# EAGLE design CAN Wing v0.1A (EAGLE 9.3.1)
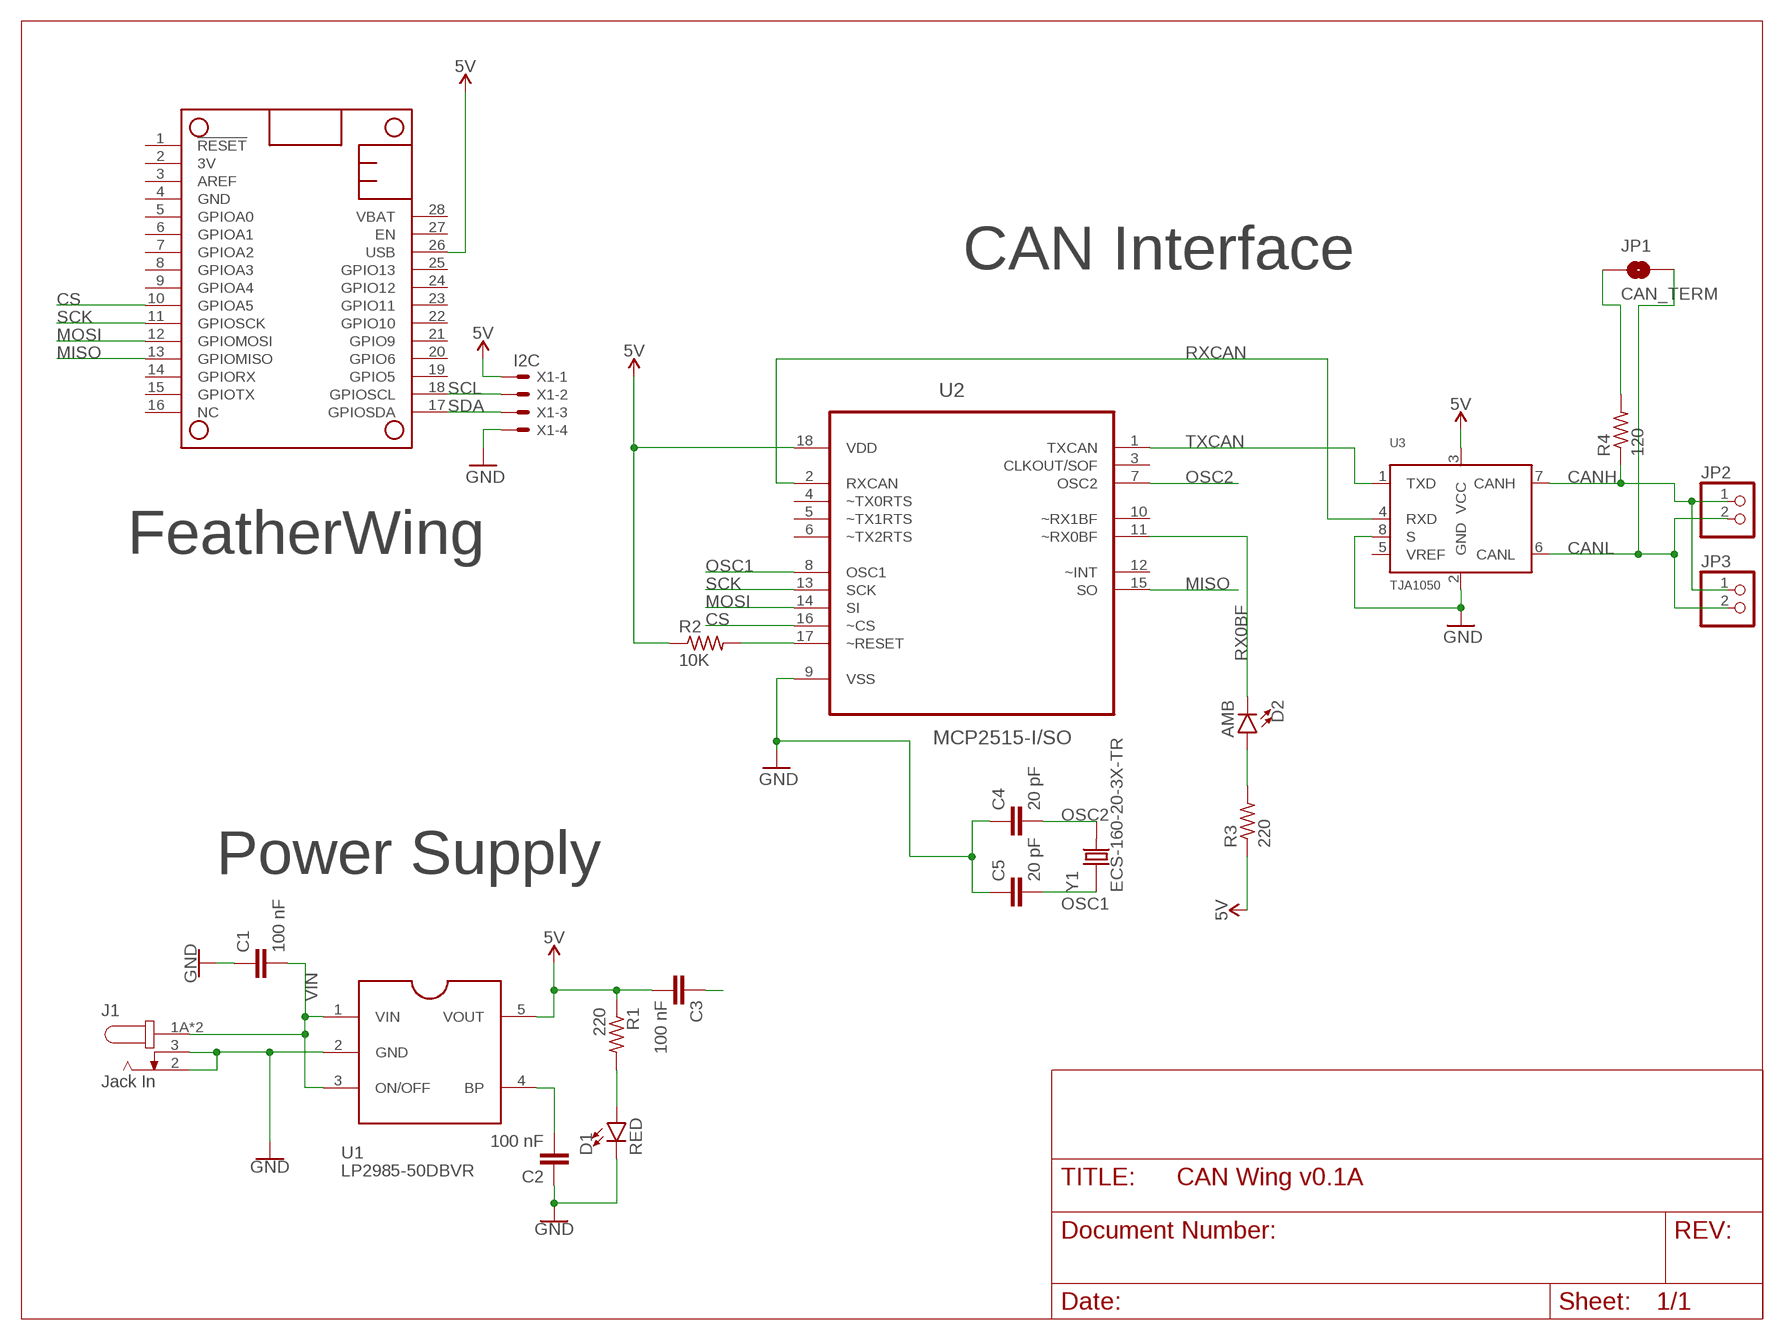
[diagram p0: schematic, sheet 1]

## Parts
C1  100 nF  C-EUC0603  [C0603]
C2  100 nF  C-EUC0603  [C0603]
C3  100 nF  C-EUC0603  [C0603]
C4  20 pF  C-EUC0603  [C0603]
C5  20 pF  C-EUC0603  [C0603]
D1  RED  LED0603  [LED-0603]
D2  AMB  LED0603  [LED-0603]
J1  Jack In  PJ-002AH-SMT-TR  [CUI_PJ-002AH-SMT-TR]
JP1  CAN_TERM  JUMPER-SMT_2_NO_NO-SILK  [SMT-JUMPER_2_NO_NO-SILK]
JP2  PINHD-1X2/90  [1X02/90]
JP3  PINHD-1X2/90  [1X02/90]
MS1  FEATHERWING  [FEATHERWING]
R1  220  R-US_R0603  [R0603]
R2  10K  R-US_R0603  [R0603]
R3  220  R-US_R0603  [R0603]
R4  120  R-US_R0603  [R0603]
U1  LP2985-50DBVR  [SOT23-5]
U2  MCP2515-I/SO  [SOIC127P1034X264-18N]
U3  TJA1050  [SOT96-1]
X1  I2C  JST-XH-04-PIN-LONG-PAD  [JST-XH-04-PACKAGE-LONG-PAD]
Y1  ECS-160-20-3X-TR  [XTAL_ECS-160-20-3X-TR]

## Nets
5V: C3.2 MS1.26(USB) R1.1 R2.1 R3.1 U1.5(VOUT) U2.18(VDD) U3.3(VCC) X1.1
CANH: JP2.1 JP3.1 R4.1 U3.7(CANH)
CANL: JP1.2 JP2.2 JP3.2 U3.6(CANL)
CS: MS1.10(GPIOA5) U2.16(~CS)
GND: C1.1 C2.1 C3.1 C4.1 C5.1 D1.C J1.2 J1.3 U1.2(GND) U2.9(VSS) U3.2(GND) U3.8(S) X1.4
MISO: MS1.13(GPIOMISO) U2.15(SO)
MOSI: MS1.12(GPIOMOSI) U2.14(SI)
N$3: JP1.1 R4.2
N$4: R2.2 U2.17(~RESET)
N$7: C2.2 U1.4(BP)
N$8: D1.A R1.2
N$9: D2.A R3.2
OSC1: C5.2 U2.8(OSC1) Y1.1
OSC2: C4.2 U2.7(OSC2) Y1.2
RX0BF: D2.C U2.11(~RX0BF)
RXCAN: U2.2(RXCAN) U3.4(RXD)
SCK: MS1.11(GPIOSCK) U2.13(SCK)
SCL: MS1.18(GPIOSCL) X1.2
SDA: MS1.17(GPIOSDA) X1.3
TXCAN: U2.1(TXCAN) U3.1(TXD)
VIN: C1.2 J1.1A J1.1B U1.1(VIN) U1.3(ON/OFF)
Unconnected: MS1.1(!RESET) MS1.2(3V) MS1.3(AREF) MS1.5(GPIOA0) MS1.6(GPIOA1) MS1.7(GPIOA2) MS1.8(GPIOA3) MS1.9(GPIOA4) MS1.14(GPIORX) MS1.15(GPIOTX) MS1.16(NC) MS1.19(GPIO5) MS1.20(GPIO6) MS1.21(GPIO9) MS1.22(GPIO10) MS1.23(GPIO11) MS1.24(GPIO12) MS1.25(GPIO13) MS1.27(EN) MS1.28(VBAT) U2.3(CLKOUT/SOF) U2.4(~TX0RTS) U2.5(~TX1RTS) U2.6(~TX2RTS) U2.10(~RX1BF) U2.12(~INT) U3.5(VREF)

## Notes on the sheet
- CAN Interface
- FeatherWing
- Power Supply

## Power pins joined to a net without a drawn wire
GND: MS1.4(GND)

## Library data of the parts
C1-C5 = rcl:C-EU: CAPACITOR, European symbol; SPICEPREFIX: C
D1 D2 = SparkFun-LED:LED: LED (Generic) Standard schematic elements and footprints for 5mm, 3mm, 1206, and 0603 sized LEDs. Generic LEDs with no color specified.
J1 = PJ-002AH-SMT-TR:PJ-002AH-SMT-TR: 2.0 mm Center Pin, 5.0 A, Right Angle, Surface Mount (SMT), Dc Power Jack Connector; CUI_PURCHASE_URL: https://www.cui.com/product/interconnect/dc-power-connectors/jacks/2.0-mm-center-pin/pj-002ah-smt-tr?utm_source=snapeda.com&utm_medium=referral&utm_campaign=snapedaBOM; DESCRIPTION: 24 VDC 5 A Surface Mount Unshielded 2 Conductors 3 Contacts Male Power Jack; DIGI-KEY_PART_NUMBER: CP-002AHPJCT-ND; DIGI-KEY_PURCHASE_URL: https://www.digikey.com/product-detail/en/cui-inc/PJ-002AH-SMT-TR/CP-002AHPJCT-ND/669692?utm_source=snapeda&utm_medium=aggregator&utm_campaign=symbol; MF: CUI Inc.; MP: PJ-002AH-SMT-TR; PACKAGE: None
JP1 = SparkFun-Jumpers:JUMPER-SMT_2_NO: Normally open jumper This jumper has two pads in close proximity to each other. Apply solder to close the connection. Round pads are easier to solder for beginners, but are a lot larger. SparkFun Product that uses the round pads: SparkFun EL Sequencer <https://www.sparkfun.com/products/12781>
JP2 JP3 = pinhead:PINHD-1X2: PIN HEADER
MS1 = microbuilder:FEATHERWING
R1-R4 = rcl:R-US_: RESISTOR, American symbol; SPICEPREFIX: R
U1 = LP2985-50DBVR:LP2985-50DBVR: http://octopart.com/lp2985-50dbvr-texas+instruments-525993; AVAILABILITY: Unavailable; DESCRIPTION: Single Output LDO, 150mA, Fixed_5.0V_, 1.5% Tolerance, Low Quiescent Current, Low Noise 5-SOT-23 -40 to 125; MF: Texas Instruments; MP: LP2985-50DBVR; PACKAGE: SOT-23 Texas Instruments; PRICE: None
U2 = MCP2515-I_SO:MCP2515-I/SO: CAN Controller; DESCRIPTION: MCP2515 Series 5.5 V 1 Mb/s Stand Alone SPI Interface CAN Controller- SOIC-18; DIGI-KEY_PART_NUMBER: MCP2515-I/SO-ND; DIGI-KEY_PURCHASE_URL: https://www.digikey.com/product-detail/en/microchip-technology/MCP2515-I-SO/MCP2515-I-SO-ND/593001?utm_source=snapeda&utm_medium=aggregator&utm_campaign=symbol; MF: Microchip; MP: MCP2515-I/SO; PACKAGE: SOIC-18 Microchip
U3 = TJA1050:TJA1050: High speed CAN transceiver The TJA1050 is the interface between the Controller Area Network (CAN) protocol controller and the physical bus. The device provides differential transmit capability to the bus and differential receive capability to the CAN controller. The TJA1050 is the third Philips high-speed CAN transceiver after the PCA82C250 and the PCA82C251. The most important differences are: Much lower electromagnetic emission due to optimal matching of the output signals CANH and CANL Improved behaviour in case of an unpowered node No standby mode. This makes the TJA1050 eminently suitable for use in nodes that are in a power-down situation in partially powered networks. AAL Eindhoven MK; DIGI-KEY_PART_NUMBER: 568-10292-1-ND; DIGI-KEY_PURCHASE_URL: https://www.digikey.com/product-detail/en/nxp-usa-inc/TJA1050T-CM,118/568-10292-1-ND/4162437?utm_source=snapeda&utm_medium=aggregator&utm_campaign=symbol; MF: NXP USA; MP: TJA1050; PACKAGE: SOIC-8 NXP USA
X1 = Rembrandt Electronics - JST XH Connectors v1-0:JST-XH-04-PIN: JST XH Connector 2 Pin Wire to board connector. Pitch: 2,54 mm, (0.100") Number of pins: 4 Created by Rembrandt Electronics www.rembrandtelectronics.com
Y1 = ECS-160-20-3X-TR:ECS-160-20-3X-TR: SMD QUARTZ CRYSTAL; AVAILABILITY: Unavailable; DESCRIPTION: CSM-3X Series 16 MHz ±30 ppm 20 pF -10 to +70 °C Surface Mount Quartz Crystal; MF: ECS Inc.; MP: ECS-160-20-3X-TR; PACKAGE: HC49/US ECS International; PRICE: None

## Board
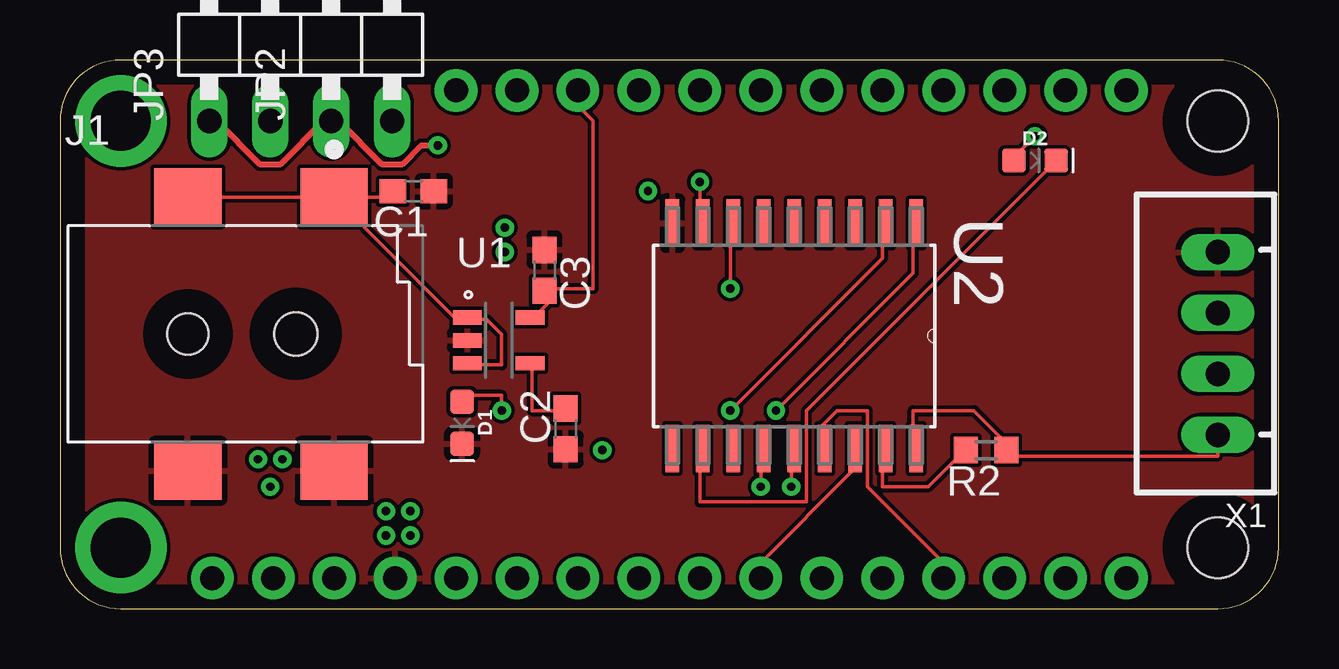
[diagram p1: board, top side]
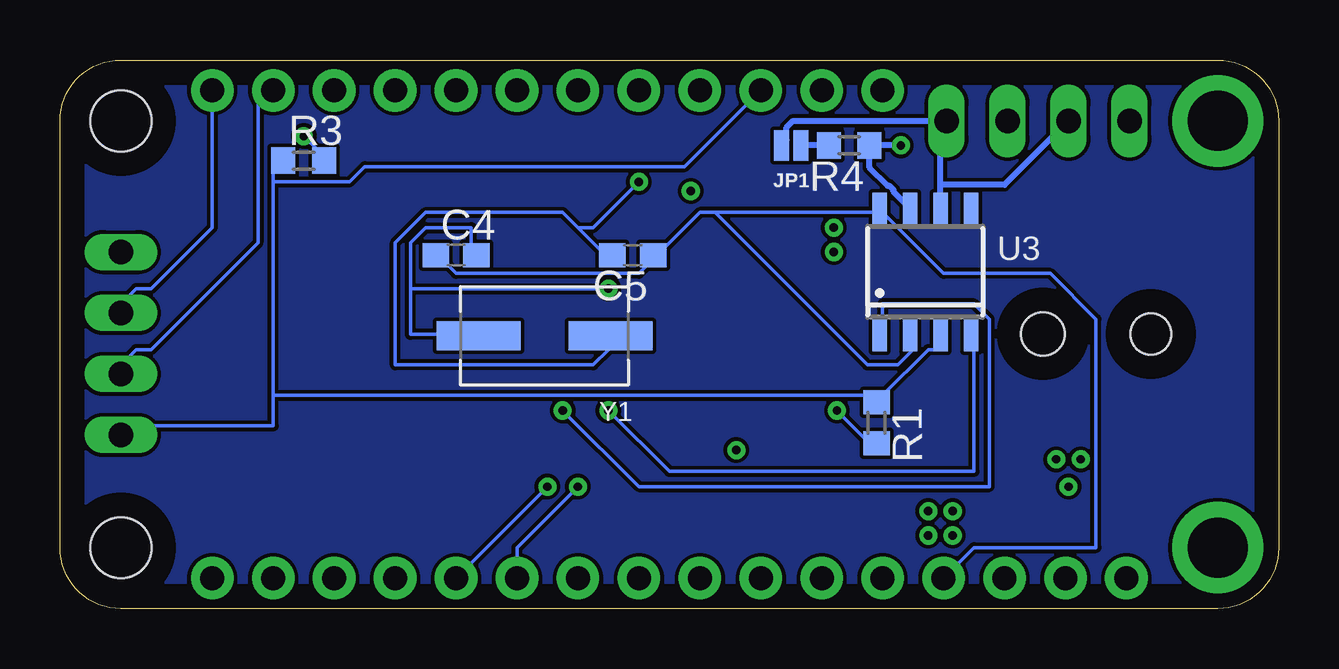
[diagram p2: board, bottom side, seen from below]

Size 50.8 x 22.86 mm. Coordinates in mm from the lower left corner, seen from the top.
Copper layers (1*16): Top 0.035mm / dielectric 1.5mm / Bottom 0.035mm
Design rules "default": minimum track width 6mil, minimum drill 0.35mm, track to track 6mil, track to pad 6mil, pad to pad 6mil, via to via 6mil, smd to smd 6mil, copper to edge 40mil, drill to drill 6mil, minimum pad ring 10mil, minimum via ring 8mil, stop-mask expansion 4mil, vias tented up to drill 0mil, thermal gap 10mil

### Footprints (pad centres in the part's own frame; a part is rotated, then mirrored left to right if it is on the bottom)
C0603 = smd 1.1 x 1: 1 -0.85,0; 2 0.85,0
LED-0603 = smd 1 x 1: A -0.877,0; C 0.877,0
CUI_PJ-002AH-SMT-TR = smd 2.8 x 2.4: 1A 0,0; 1B -6.1,0; 2 -6.1,-11.4; 3 0,-11.4 | hole 1.7: -6.1,-5.7 | hole 1.8: -1.6,-5.7
SMT-JUMPER_2_NO_NO-SILK = smd 0.635 x 1.27: 1 -0.406,0; 2 0.406,0
1X02/90 = drill 1.016 long: 1 -1.27,-3.81; 2 1.27,-3.81
FEATHERWING = drill 1 pad 1.778: 1 6.35,1.27; 2 8.89,1.27; 3 11.43,1.27; 4 13.97,1.27; 5 16.51,1.27; 6 19.05,1.27; 7 21.59,1.27; 8 24.13,1.27; 9 26.67,1.27; 10 29.21,1.27; 11 31.75,1.27; 12 34.29,1.27; 13 36.83,1.27; 14 39.37,1.27; 15 41.91,1.27; 16 44.45,1.27; 17 44.45,21.59; 18 41.91,21.59; 19 39.37,21.59; 20 36.83,21.59; 21 34.29,21.59; 22 31.75,21.59; 23 29.21,21.59; 24 26.67,21.59; 25 24.13,21.59; 26 21.59,21.59; 27 19.05,21.59; 28 16.51,21.59 | drill 2.5 pad 3.81: P$1 2.54,20.32; P$2 2.54,2.54 | hole 2.54: 48.26,20.32; 48.26,2.54
R0603 = smd 1 x 1.1: 1 -0.85,0; 2 0.85,0
SOT23-5 = smd 1.2 x 0.6: 1 -1.306,0.95; 2 -1.306,0; 3 -1.306,-0.95; 4 1.306,-0.95; 5 1.306,0.95
SOIC127P1034X264-18N = smd 1.981 x 0.559: 1 -4.699,5.08; 2 -4.699,3.81; 3 -4.699,2.54; 4 -4.699,1.27; 5 -4.699,0; 6 -4.699,-1.27; 7 -4.699,-2.54; 8 -4.699,-3.81; 9 -4.699,-5.08; 10 4.699,-5.08; 11 4.699,-3.81; 12 4.699,-2.54; 13 4.699,-1.27; 14 4.699,0; 15 4.699,1.27; 16 4.699,2.54; 17 4.699,3.81; 18 4.699,5.08
SOT96-1 = smd 0.6 x 1.3: 1 -1.905,-2.65; 2 -0.635,-2.65; 3 0.635,-2.65; 4 1.905,-2.65; 5 1.905,2.65; 6 0.635,2.65; 7 -0.635,2.65; 8 -1.905,2.65
JST-XH-04-PACKAGE-LONG-PAD = drill 1.016 long: 1 -3.81,0; 2 -1.27,0; 3 1.27,0; 4 3.81,0
XTAL_ECS-160-20-3X-TR = smd 3.5 x 1.2: 1 -2.75,0; 2 2.75,0

### Placement (x,y rotation side)
C1  14.73,17.4 180 top
C2  21.08,7.49 90 top
C3  20.19,14.1 270 top
C4  34.29,14.73 0 bottom
C5  26.92,14.73 180 bottom
D1  16.76,7.75 270 top
D2  40.64,18.67 0 top
J1  11.43,17.14 0 top
JP1  20.32,19.3 180 bottom
JP2  12.57,24.13 0 top
JP3  7.49,24.13 0 top
MS1  0,0 0 top
R1  16.76,7.75 270 bottom
R2  38.61,6.6 180 top
R3  40.64,18.67 0 bottom
R4  17.91,19.3 180 bottom
U1  18.29,11.18 0 top
U2  30.61,11.37 270 top
U3  14.73,14.03 0 bottom
X1  48.26,11.05 90 top
Y1  30.61,11.37 180 bottom

### Tracks (layer width: path | path; a pad name or v marks a point on that pad's centre or on a via)
5V
  Top 0.152: U1.5 19.68,12.06 20.32,12.7 C3.2 20.32,13.34 22.23,13.34 22.23,20.32 21.59,20.95 MS1.26 | U2.18 35.56,6.99 35.56,8.26 38.1,8.26 39.37,6.99 R2.1 39.37,6.35 48.26,6.35 X1.1
  Bottom 0.152: U3.3 13.97,10.79 14.61,10.79 16.51,8.89 R1.1 17.14,8.89 41.91,8.89 | 41.91,8.89 41.91,7.62 48.26,7.62 X1.1 | 41.91,8.89 41.91,17.78 | 41.91,17.78 41.91,18.41 R3.1 | MS1.26 24.77,18.41 38.1,18.41 38.73,17.78 41.91,17.78
CANH  (via drill 0.35)
  Top 0.254: JP3.1 6.53,20.32 8.33,18.52 9.19,18.52 11,20.32 JP2.1 11.61,20.32 13.41,18.52 14.27,18.52 15.06,19.3 v15.75,19.3
  Bottom 0.254: U3.7 16.06,17.37 16.06,17.45 16.22,17.61 16.3,17.61 17.06,18.37 R4.1 v15.75,19.3
CANL
  Bottom 0.254: U3.6 14.1,17.65 | 14.1,17.65 14.1,20.07 JP2.2 20.25,20.32 20.51,20.05 20.51,19.52 JP1.2 | JP3.2 11.43,17.65 14.1,17.65
CS
  Top 0.152: MS1.10 29.21,1.91 33.02,5.71 33.02,6.35 U2.16
GND
  Bottom 0.152: 26.04,14.61 24.13,16.51 23.5,16.51 | 16.51,16.51 23.5,16.51 | 26.04,14.61 26.67,13.97 34.29,13.97 34.92,14.61 C4.1 | 26.04,14.61 C5.1 | 23.5,16.51 17.14,10.16 15.88,10.16 15.24,10.79 U3.2 | 16.51,16.51 13.97,13.97 9.53,13.97 7.62,12.06 7.62,2.54 12.7,2.54 MS1.4 | 16.51,16.51 U3.8
  pour Top: 0,0 50.8,0 50.8,22.61 50.55,22.86 0,22.86
GND1
  pour Bottom: 0,0 50.8,0 50.8,22.61 50.55,22.86 0,22.86
MISO
  Top 0.152: MS1.13 36.83,1.91 33.66,5.08 33.66,8.26 32.38,8.26 31.75,7.62 31.75,6.99 U2.15
MOSI  (via drill 0.35)
  Top 0.152: v30.48,5.08 30.48,6.35 U2.14
  Bottom 0.152: MS1.12 v30.48,5.08
N$1  (via drill 0.35)
  other vias: 22.61,6.6
N$2  (via drill 0.35)
  other vias: 9.27,6.22
N$3
  Bottom 0.254: R4.2 JP1.1
N$4
  Top 0.152: R2.2 37.47,6.35 36.2,5.08 34.29,5.08 34.29,6.35 U2.17
N$5  (via drill 0.35)
  other vias: 8.26,6.22
N$6  (via drill 0.35)
  other vias: 8.76,5.08
N$7
  Top 0.152: C2.2 20.95,8.26 19.68,8.26 19.68,10.16 U1.4
N$8  (via drill 0.35)
  Top 0.152: v18.41,8.26 18.41,8.89 17.14,8.89 D1.A
  Bottom 0.152: v18.41,8.26 17.14,6.99 R1.2
N$9  (via drill 0.35)
  Top 0.152: v40.64,19.68 40.01,19.05 D2.A
  Bottom 0.152: v40.64,19.68 40.01,19.05 R3.2
N$10  (via drill 0.35)
  other vias: 13.59,3.05
N$11  (via drill 0.35)
  other vias: 14.61,3.05
N$12  (via drill 0.35)
  other vias: 14.61,4.06
N$13  (via drill 0.35)
  other vias: 13.59,4.06
N$14  (via drill 0.35)
  other vias: 18.54,14.86
N$15  (via drill 0.35)
  other vias: 18.54,15.88
N$16  (via drill 0.35)
  other vias: 24.51,17.4
OSC1  (via drill 0.35)
  Top 0.152: v26.67,17.78 26.67,16.51 U2.8
  Bottom 0.152: 29.21,15.88 29.84,16.51 35.56,16.51 36.83,15.24 36.83,10.16 28.57,10.16 27.94,10.79 Y1.1 | 29.21,15.88 27.94,14.61 C5.2 | v26.67,17.78 28.57,15.88 29.21,15.88
OSC2  (via drill 0.35)
  Top 0.152: v27.94,13.34 27.94,15.88 U2.7
  Bottom 0.152: 36.2,13.34 36.2,11.43 33.66,11.43 Y1.2 | 36.2,13.34 36.2,15.24 35.56,15.88 33.66,15.88 33.66,14.61 C4.2 | 36.2,13.34 v27.94,13.34
RX0BF
  Top 0.152: D2.C 41.27,18.41 31.11,8.26 31.11,4.45 26.67,4.45 26.67,6.35 U2.11
RXCAN  (via drill 0.35)
  Top 0.152: v27.94,8.26 34.29,14.61 34.29,15.88 U2.2
  Bottom 0.152: v27.94,8.26 25.4,5.71 12.7,5.71 12.7,10.79 U3.4
SCK  (via drill 0.35)
  Top 0.152: v29.21,5.08 29.21,6.35 U2.13
  Bottom 0.152: v29.21,5.08 31.75,2.54 MS1.11
SCL
  Bottom 0.152: X1.2 48.26,10.16 47.62,10.79 46.99,10.79 42.55,15.24 42.55,21.59 MS1.18
SDA
  Bottom 0.152: X1.3 48.26,12.7 47.62,13.34 46.99,13.34 44.45,15.88 MS1.17
TXCAN  (via drill 0.35)
  Top 0.152: v29.84,8.26 35.56,13.97 35.56,15.88 U2.1
  Bottom 0.152: v29.84,8.26 26.67,5.08 12.06,5.08 12.06,12.06 12.7,12.7 16.51,12.7 16.51,11.43 U3.1
VIN
  Top 0.152: U1.3 17.14,10.16 18.41,10.16 18.41,11.43 17.78,12.06 17.14,12.06 U1.1 16.51,12.06 12.7,15.88 12.7,17.14 | 12.7,17.14 13.34,17.14 C1.2 | 12.7,17.14 J1.1A J1.1B

### Text on the board
tSilk: CAN Bus Feather Wing v0.1A / For use with Adafruit Feather | BUFFER | _ | SDA | SCL | 5V | POW | V | Vin Max 16V | Designed 06/19 / Florida Tech, OEMS
_bsilk: H | L | H | L
200bmp: D:/OneDrive - Florida Institute of Technology/Projects/Project Argo/ECAD Files/References/Pinky and the Brain MC.bmp